# Altium schematic sheet LLN-24VDimmer.SchDoc: Overview
size A3; DocumentNumber: 1; Revision: 1.0; SheetNumber: 1; SheetTotal: 4
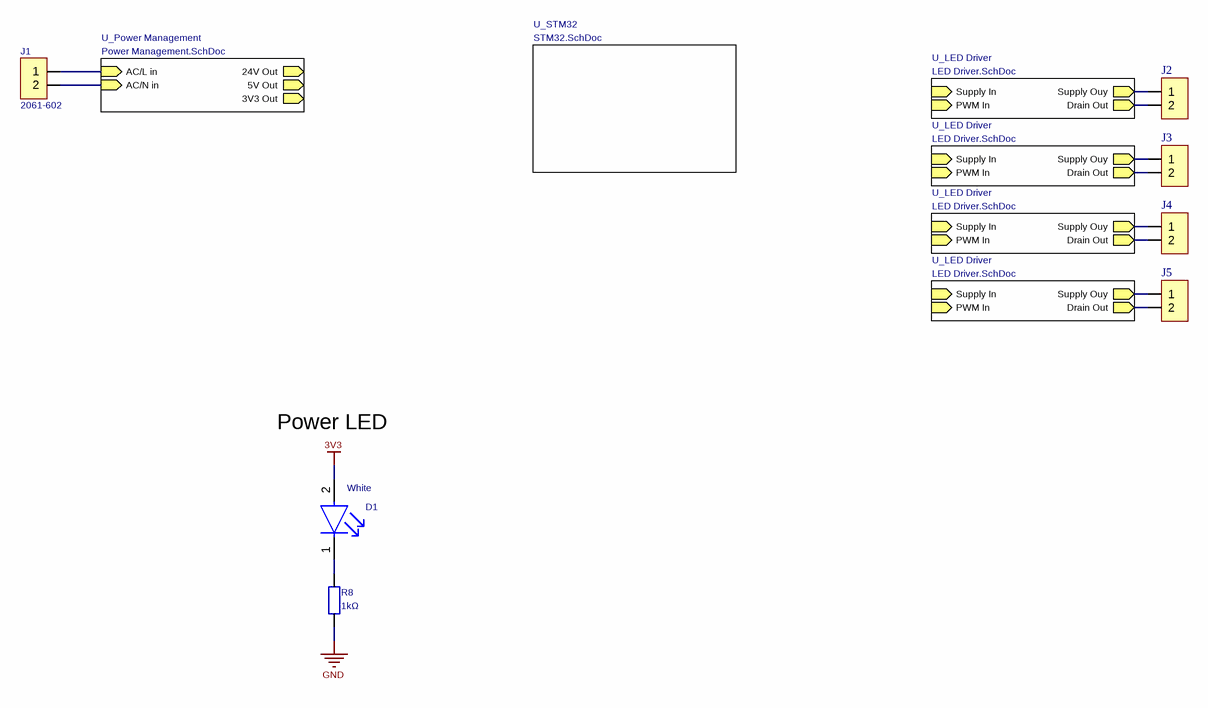
[diagram p0: LLN-24VDimmer.SchDoc]

## Parts
D1  value White  [LEDC1608X08N]
J1  MPN: 2061-602  [WAGO_2061-602/998-404]
J2  (no value)  [WAGO_2060-452/998-404]
J3  (no value)  [WAGO_2060-452/998-404]
J4  (no value)  [WAGO_2060-452/998-404]
J5  (no value)  [WAGO_2060-452/998-404]
R8  value 1kΩ  [RESC1005X04N]

## Sub-sheets
U_LED Driver = LED Driver.SchDoc: PWM In (in), Drain Out (out), Supply Ouy (out), Supply In (in)
U_LED Driver = LED Driver.SchDoc: PWM In (in), Drain Out (out), Supply Ouy (out), Supply In (in)
U_LED Driver = LED Driver.SchDoc: PWM In (in), Drain Out (out), Supply Ouy (out), Supply In (in)
U_LED Driver = LED Driver.SchDoc: PWM In (in), Drain Out (out), Supply Ouy (out), Supply In (in)
U_Power Management = Power Management.SchDoc: 5V Out (out), 3V3 Out (out), 24V Out (out), AC/L in (in), AC/N in (in)
U_STM32 = STM32.SchDoc: no entries

## Nets
3V3: D1.2(A)
GND: R8.2
NetD1_1: D1.1(C) R8.1
NetJ1_1: J1.1 ; sheet U_Power Management/AC/L in
NetJ1_2: J1.2 ; sheet U_Power Management/AC/N in
NetJ2_1: J2.1 ; sheet U_LED Driver/Supply Ouy
NetJ2_2: J2.2 ; sheet U_LED Driver/Drain Out
NetJ3_1: J3.1 ; sheet U_LED Driver/Supply Ouy
NetJ3_2: J3.2 ; sheet U_LED Driver/Drain Out
NetJ4_1: J4.1 ; sheet U_LED Driver/Supply Ouy
NetJ4_2: J4.2 ; sheet U_LED Driver/Drain Out
NetJ5_1: J5.1 ; sheet U_LED Driver/Supply Ouy
NetJ5_2: J5.2 ; sheet U_LED Driver/Drain Out

## Notes on the sheet
- Power LED
- Redako
- Keilestraat 5a, 3029BP, Rotterdam, M: david@redako.nl, T: +31 6 16001008
- Project
- Title
- Customer
- Size:
- Date:
- File:
- A4
- Revision:
- Time:
- Drawn by:
- GIT Revision:
- Sheet:
- of

## Library data of the parts
D1 = CMP-22017-000005-1: LED; MPN: KT-0603W; Package: 0603
J1-J5 = JST_Connector_2Pin
R8 = Res: MPN: 0402WGF1001TCE; Package: 0402